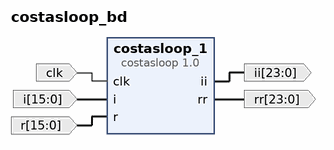
[diagram p0: block diagram of the top level]
# Vivado block design costasloop_bd, xc7k160tfbg484-2, Vivado 2021.2
create_bd_design costasloop_bd

create_bd_port -dir I -type clk clk
create_bd_port -dir I -from 15 -to 0 -type data i
create_bd_port -dir O -from 23 -to 0 -type data ii
create_bd_port -dir I -from 15 -to 0 -type data r
create_bd_port -dir O -from 23 -to 0 -type data rr

create_bd_cell -type ip -vlnv User_Company:SysGen:costasloop:1.0 costasloop_1

# ---- connections ----

connect_bd_net [get_bd_ports clk] [get_bd_pins costasloop_1/clk]
connect_bd_net [get_bd_pins costasloop_1/ii] [get_bd_ports ii]
connect_bd_net [get_bd_pins costasloop_1/rr] [get_bd_ports rr]
connect_bd_net [get_bd_ports i] [get_bd_pins costasloop_1/i]
connect_bd_net [get_bd_ports r] [get_bd_pins costasloop_1/r]

validate_bd_design
save_bd_design
